# Altium schematic sheet FPGA_NonIO.SchDoc: FPGA Power and Programming
size A4; Organization: Altium Limited.; Address1: Level 3, 12a Rodborough Rd; Address2: Frenchs Forest 2086; Address3: NSW; Address4: AUSTRALIA; SheetNumber: 7; SheetTotal: 21
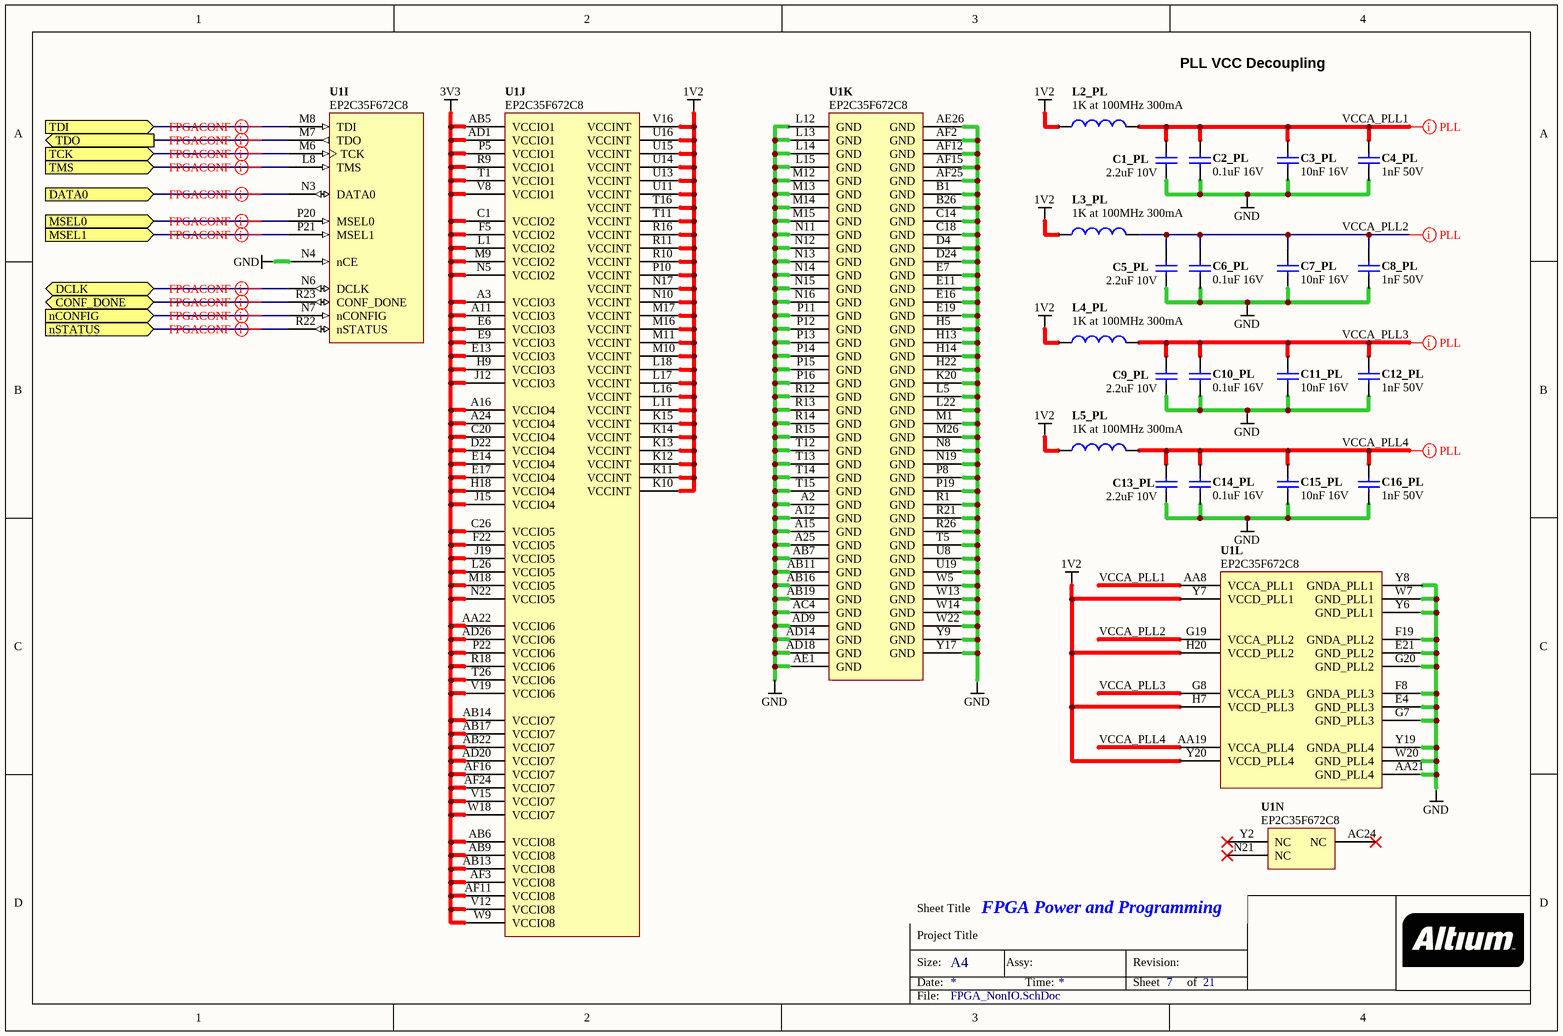
[diagram p0: FPGA_NonIO.SchDoc]

## Parts
C1_PL  2.2uF 10V  [CAPC1608-STAR]
C2_PL  0.1uF 16V  [CAPC1005-STAR]
C3_PL  10nF 16V  [CAPC1005-STAR]
C4_PL  1nF 50V  [CAPC1005-STAR]
C5_PL  2.2uF 10V  [CAPC1608-STAR]
C6_PL  0.1uF 16V  [CAPC1005-STAR]
C7_PL  10nF 16V  [CAPC1005-STAR]
C8_PL  1nF 50V  [CAPC1005-STAR]
C9_PL  2.2uF 10V  [CAPC1608-STAR]
C10_PL  0.1uF 16V  [CAPC1005-STAR]
C11_PL  10nF 16V  [CAPC1005-STAR]
C12_PL  1nF 50V  [CAPC1005-STAR]
C13_PL  2.2uF 10V  [CAPC1608-STAR]
C14_PL  0.1uF 16V  [CAPC1005-STAR]
C15_PL  10nF 16V  [CAPC1005-STAR]
C16_PL  1nF 50V  [CAPC1005-STAR]
L2_PL  1K at 100MHz 300mA  [INDC2012-STAR]
L3_PL  1K at 100MHz 300mA  [INDC2012-STAR]
L4_PL  1K at 100MHz 300mA  [INDC2012-STAR]
L5_PL  1K at 100MHz 300mA  [INDC2012-STAR]
U1  EP2C35F672C8  [BGA100P26X26-672]  (parts I,J,K,L,N of 14)

## Ports
CONF_DONE (bidir), DATA0 (in), DCLK (bidir), MSEL0 (in), MSEL1 (in), nCONFIG (in), nSTATUS (in), TCK (in), TDI (in), TDO (out), TMS (in)

## Nets
1V2: L2_PL.1 L3_PL.1 L4_PL.1 L5_PL.1 U1.H7(VCCD_PLL3) U1.H20(VCCD_PLL2) U1.K10(VCCINT) U1.K11(VCCINT) U1.K12(VCCINT) U1.K13(VCCINT) U1.K14(VCCINT) U1.K15(VCCINT) U1.L11(VCCINT) U1.L16(VCCINT) U1.L17(VCCINT) U1.L18(VCCINT) U1.M10(VCCINT) U1.M11(VCCINT) U1.M16(VCCINT) U1.M17(VCCINT) U1.N10(VCCINT) U1.N17(VCCINT) U1.P10(VCCINT) U1.R10(VCCINT) U1.R11(VCCINT) U1.R16(VCCINT) U1.T11(VCCINT) U1.T16(VCCINT) U1.U11(VCCINT) U1.U13(VCCINT) U1.U14(VCCINT) U1.U15(VCCINT) U1.U16(VCCINT) U1.V16(VCCINT) U1.Y7(VCCD_PLL1) U1.Y20(VCCD_PLL4)
3V3: U1.A3(VCCIO3) U1.A11(VCCIO3) U1.A16(VCCIO4) U1.A24(VCCIO4) U1.AA22(VCCIO6) U1.AB5(VCCIO1) U1.AB6(VCCIO8) U1.AB9(VCCIO8) U1.AB13(VCCIO8) U1.AB14(VCCIO7) U1.AB17(VCCIO7) U1.AB22(VCCIO7) U1.AD1(VCCIO1) U1.AD20(VCCIO7) U1.AD26(VCCIO6) U1.AF3(VCCIO8) U1.AF11(VCCIO8) U1.AF16(VCCIO7) U1.AF24(VCCIO7) U1.C1(VCCIO2) U1.C20(VCCIO4) U1.C26(VCCIO5) U1.D22(VCCIO4) U1.E6(VCCIO3) U1.E9(VCCIO3) U1.E13(VCCIO3) U1.E14(VCCIO4) U1.E17(VCCIO4) U1.F5(VCCIO2) U1.F22(VCCIO5) U1.H9(VCCIO3) U1.H18(VCCIO4) U1.J12(VCCIO3) U1.J15(VCCIO4) U1.J19(VCCIO5) U1.L1(VCCIO2) U1.L26(VCCIO5) U1.M9(VCCIO2) U1.M18(VCCIO5) U1.N5(VCCIO2) U1.N22(VCCIO5) U1.P5(VCCIO1) U1.P22(VCCIO6) U1.R9(VCCIO1) U1.R18(VCCIO6) U1.T1(VCCIO1) U1.T26(VCCIO6) U1.V8(VCCIO1) U1.V12(VCCIO8) U1.V15(VCCIO7) U1.V19(VCCIO6) U1.W9(VCCIO8) U1.W18(VCCIO7)
GND: C1_PL.2 C2_PL.2 C3_PL.2 C4_PL.2 C5_PL.2 C6_PL.2 C7_PL.2 C8_PL.2 C9_PL.2 C10_PL.2 C11_PL.2 C12_PL.2 C13_PL.2 C14_PL.2 C15_PL.2 C16_PL.2 U1.A2(GND) U1.A12(GND) U1.A15(GND) U1.A25(GND) U1.AA21(GND_PLL4) U1.AB7(GND) U1.AB11(GND) U1.AB16(GND) U1.AB19(GND) U1.AC4(GND) U1.AD9(GND) U1.AD14(GND) U1.AD18(GND) U1.AE1(GND) U1.AE26(GND) U1.AF2(GND) U1.AF12(GND) U1.AF15(GND) U1.AF25(GND) U1.B1(GND) U1.B26(GND) U1.C14(GND) U1.C18(GND) U1.D4(GND) U1.D24(GND) U1.E4(GND_PLL3) U1.E7(GND) U1.E11(GND) U1.E16(GND) U1.E19(GND) U1.E21(GND_PLL2) U1.F8(GNDA_PLL3) U1.F19(GNDA_PLL2) U1.G7(GND_PLL3) U1.G20(GND_PLL2) U1.H5(GND) U1.H13(GND) U1.H14(GND) U1.H22(GND) U1.K20(GND) U1.L5(GND) U1.L12(GND) U1.L13(GND) U1.L14(GND) U1.L15(GND) U1.L22(GND) U1.M1(GND) U1.M12(GND) U1.M13(GND) U1.M14(GND) U1.M15(GND) U1.M26(GND) U1.N4(nCE) U1.N8(GND) U1.N11(GND) U1.N12(GND) U1.N13(GND) U1.N14(GND) U1.N15(GND) U1.N16(GND) U1.N19(GND) U1.P8(GND) U1.P11(GND) U1.P12(GND) U1.P13(GND) U1.P14(GND) U1.P15(GND) U1.P16(GND) U1.P19(GND) U1.R1(GND) U1.R12(GND) U1.R13(GND) U1.R14(GND) U1.R15(GND) U1.R21(GND) U1.R26(GND) U1.T5(GND) U1.T12(GND) U1.T13(GND) U1.T14(GND) U1.T15(GND) U1.U8(GND) U1.U19(GND) U1.W5(GND) U1.W7(GND_PLL1) U1.W13(GND) U1.W14(GND) U1.W20(GND_PLL4) U1.W22(GND) U1.Y6(GND_PLL1) U1.Y8(GNDA_PLL1) U1.Y9(GND) U1.Y17(GND) U1.Y19(GNDA_PLL4)
CONF_DONE: U1.R23(CONF_DONE) ; port CONF_DONE
DATA0: U1.N3(DATA0) ; port DATA0
DCLK: U1.N6(DCLK) ; port DCLK
MSEL0: U1.P20(MSEL0) ; port MSEL0
MSEL1: U1.P21(MSEL1) ; port MSEL1
nCONFIG: U1.N7(nCONFIG) ; port nCONFIG
nSTATUS: U1.R22(nSTATUS) ; port nSTATUS
TCK: U1.M6(TCK) ; port TCK
TDI: U1.M8(TDI) ; port TDI
TDO: U1.M7(TDO) ; port TDO
TMS: U1.L8(TMS) ; port TMS
VCCA_PLL1: C1_PL.1 C2_PL.1 C3_PL.1 C4_PL.1 L2_PL.2 U1.AA8(VCCA_PLL1)
VCCA_PLL2: C5_PL.1 C6_PL.1 C7_PL.1 C8_PL.1 L3_PL.2 U1.G19(VCCA_PLL2)
VCCA_PLL3: C9_PL.1 C10_PL.1 C11_PL.1 C12_PL.1 L4_PL.2 U1.G8(VCCA_PLL3)
VCCA_PLL4: C13_PL.1 C14_PL.1 C15_PL.1 C16_PL.1 L5_PL.2 U1.AA19(VCCA_PLL4)

Not connected (* = marked no-connect by the designer): U1 AC24(NC)* N21(NC)* Y2(NC)*

## Layout directives
net class FPGACONF: CONF_DONE, DATA0, DCLK, MSEL0, MSEL1, nCONFIG, nSTATUS, TCK, TDI, TDO, TMS
net class PLL: VCCA_PLL1, VCCA_PLL2, VCCA_PLL3, VCCA_PLL4

## Notes on the sheet
- PLL VCC Decoupling
- Sheet Title
- Project Title
- Size:
- Date:
- A4
- Assy:
- Time:
- Revision:
- Sheet
- of
- File:

## Library data of the parts
C1_PL C5_PL C9_PL C13_PL = D-101-0095: Capacitor, Ceramic, 2.2uF 10% 10V 0603 (1608) X5R; Polarity: Non-Polarized; Capacitance: 2.2 uF; Dielectric: X5R; Mounting Technology: Surface Mount; Rated Voltage: 10 V; Status: Unreleased; Technology: Ceramic; Tolerance: 10 %; Category: Capacitor
C2_PL C6_PL C10_PL C14_PL = D-101-0080: Capacitor, Ceramic, 0.1uF 10% 16V 0402 (1005) X7R; Polarity: Non-Polarized; Capacitance: 0.1 uF; Dielectric: X7R; Mounting Technology: Surface Mount; Rated Voltage: 16 V; Status: Production; Technology: Ceramic; Tolerance: 10 %; Category: Capacitor
C3_PL C7_PL C11_PL C15_PL = D-101-0077: Capacitor, Ceramic, 10nF 10% 16V 0402 (1005) X7R; Polarity: Non-Polarized; Capacitance: 10 nF; Dielectric: X7R; Mounting Technology: Surface Mount; Rated Voltage: 16 V; Status: Production; Technology: Ceramic; Tolerance: 10 %; Category: Capacitor
C4_PL C8_PL C12_PL C16_PL = D-101-0030: Capacitor, Ceramic, 1nF 10% 50V 0402 (1005) X7R; Polarity: Non-Polarized; Capacitance: 1 nF; Dielectric: X7R; Mounting Technology: Surface Mount; Rated Voltage: 50 V; Status: Production; Technology: Ceramic; Tolerance: 10 %; Category: Capacitor
L2_PL L3_PL L4_PL L5_PL = D-102-0002: Inductor, Ferrite Bead 1K@100MHz 300mA 0805 (2012) BMB2A1000LN2; Inductance: nH; Max Input Current: 300 mA; Mounting Technology: Surface Mount; Status: Production; Category: Inductor
U1 = D-241-0004: FPGA, Altera Cyclone2-35 F672; Supply Voltage: mV; Mounting Technology: Surface Mount; Status: Production; Technology: None; Category: IC-FPGA